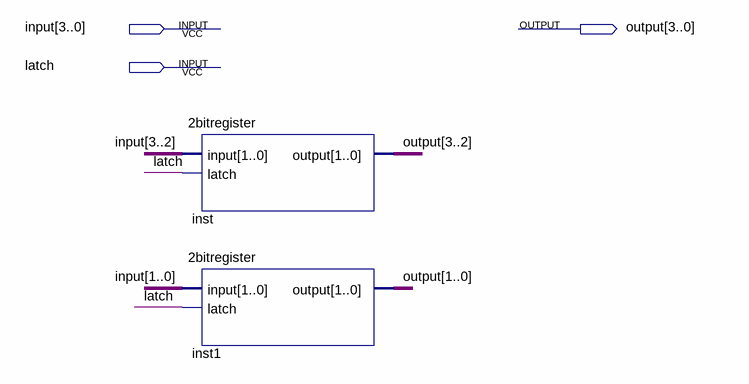
[diagram p0: schematic sheet]
// Quartus schematic 4bitregister.bdf as structural Verilog: 2 symbols, 3 pins
module \4bitregister  (
  input  [3:0] \input ,
  input  latch,
  output [3:0] \output 
);

  \2bitregister  inst (.\input (\input [3:2]), .latch(latch), .\output (\output [3:2]));
  \2bitregister  inst1 (.\input (\input [1:0]), .latch(latch), .\output (\output [1:0]));
endmodule
